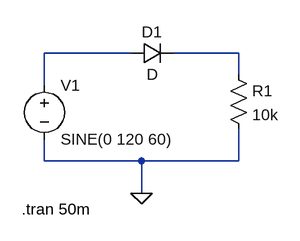
[diagram p0: schematic meiaonda.asc]
meiaonda.asc, the LTspice schematic file:
Version 4
SHEET 1 880 680
WIRE 112 96 -16 96
WIRE 272 96 176 96
WIRE 272 128 272 96
WIRE -16 144 -16 96
WIRE -16 256 -16 224
WIRE 128 256 -16 256
WIRE 272 256 272 208
WIRE 272 256 128 256
WIRE 128 304 128 256
FLAG 128 304 0
SYMBOL voltage -16 128 R0
WINDOW 123 0 0 Left 0
WINDOW 39 0 0 Left 0
SYMATTR InstName V1
SYMATTR Value SINE(0 120 60)
SYMBOL diode 112 112 R270
WINDOW 0 32 32 VTop 2
WINDOW 3 0 32 VBottom 2
SYMATTR InstName D1
SYMBOL res 256 112 R0
SYMATTR InstName R1
SYMATTR Value 10k
TEXT -50 328 Left 2 !.tran 50m

The netlist it stands for:
* meiaonda.asc
V1 N001 0 SINE(0 120 60)
D1 N001 N002 D
R1 N002 0 10k
.model D D
.lib standard.dio
.tran 50m
.backanno
.end